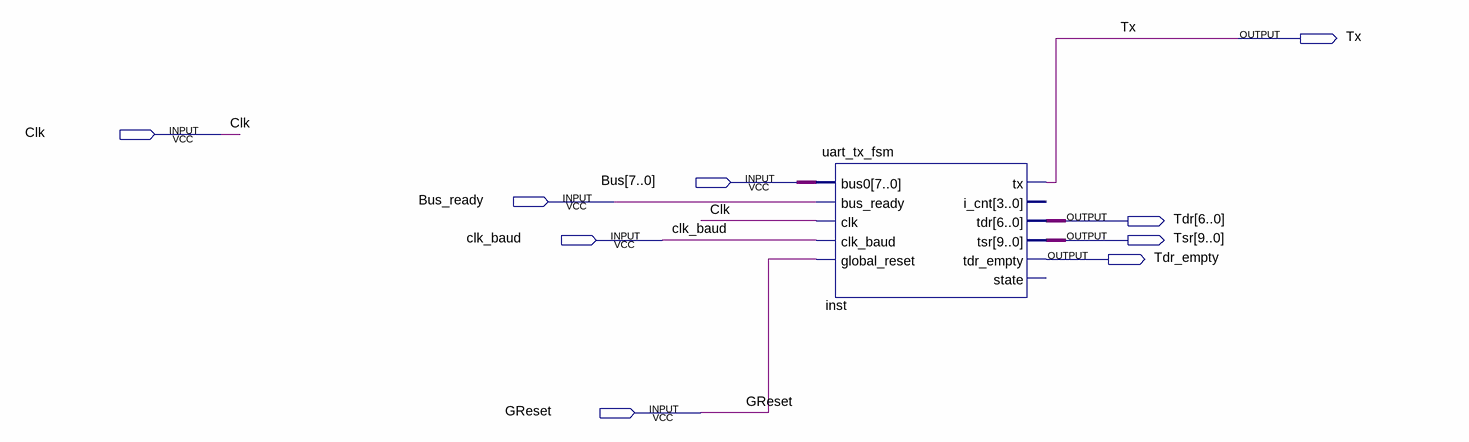
[diagram p0: schematic sheet]
// Quartus schematic txTest.bdf as structural Verilog: 1 symbols, 9 pins
module txTest (
  input  Clk,
  input  [7:0] Bus,
  input  Bus_ready,
  input  clk_baud,
  input  GReset,
  output Tx,
  output [6:0] Tdr,
  output [9:0] Tsr,
  output Tdr_empty
);

  uart_tx_fsm inst (
    .bus0(Bus), .bus_ready(Bus_ready), .clk(Clk), .clk_baud(clk_baud), .global_reset(GReset), .tx(Tx),
    .tdr(Tdr), .tsr(Tsr), .tdr_empty(Tdr_empty));  // open: i_cnt, state
endmodule
